# EAGLE schematic inverter-1kw (EAGLE 9.6.2)
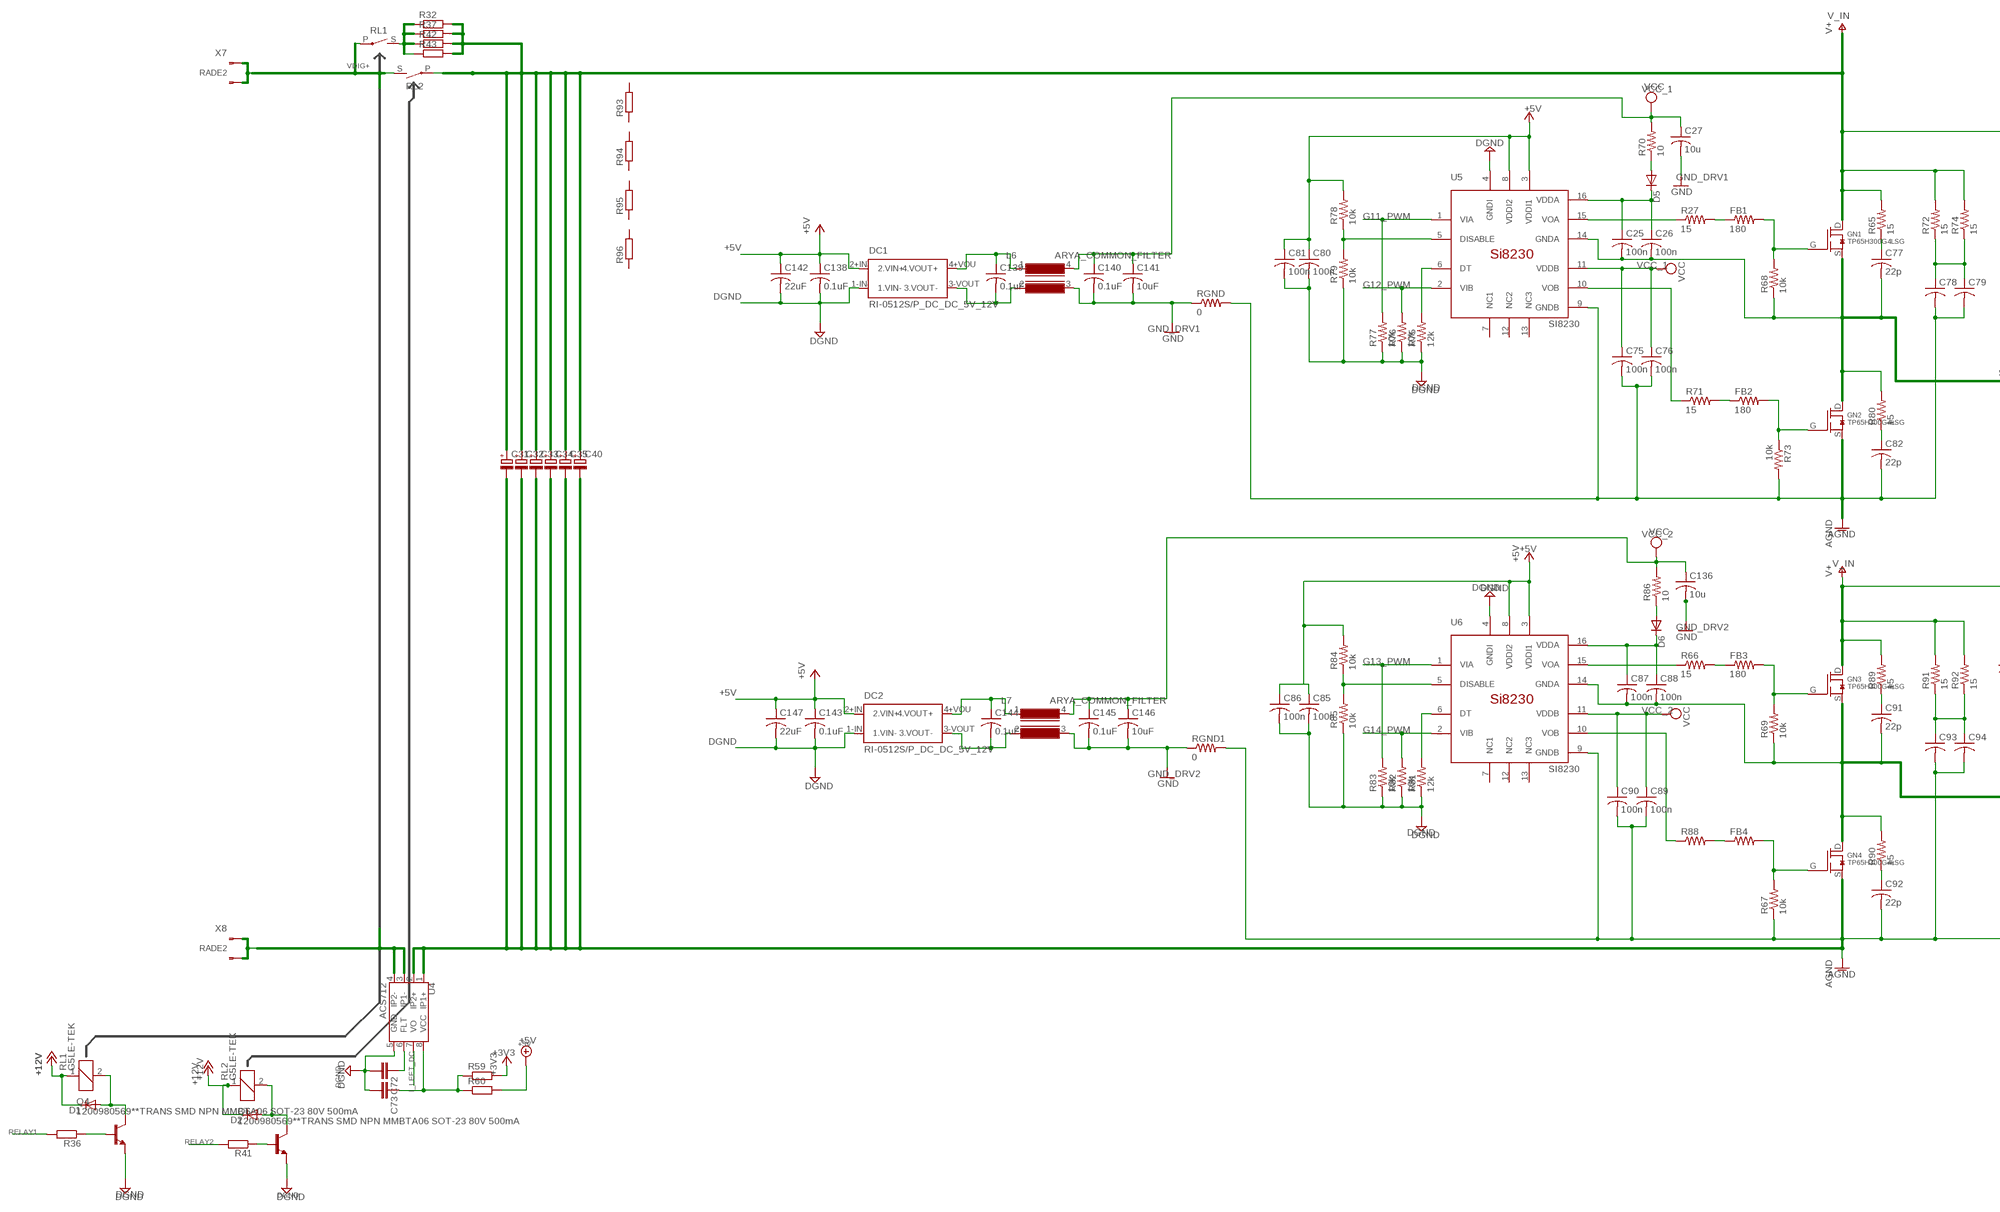
[diagram p0: schematic, sheet 1, part 1 of 3]
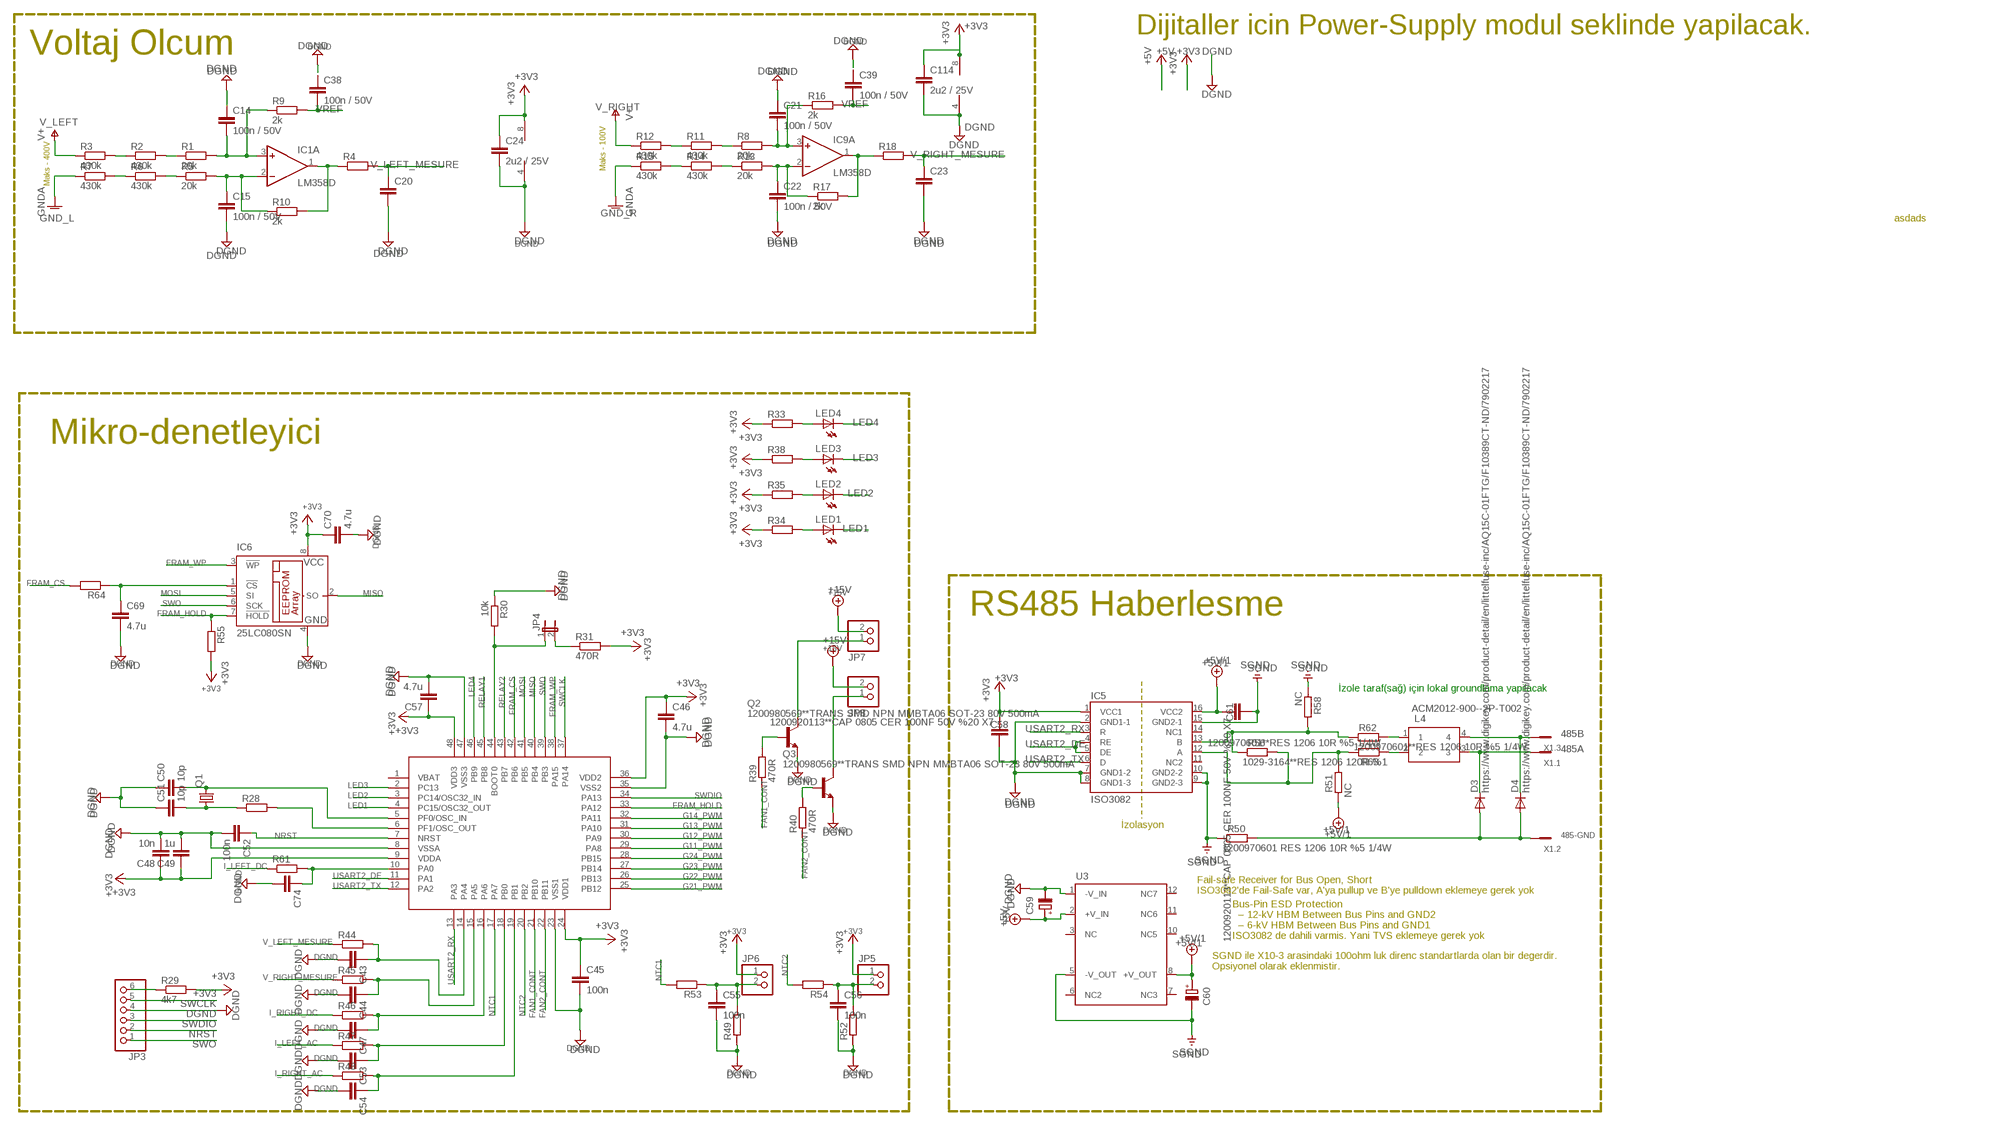
[diagram p1: schematic, sheet 1, part 2 of 3]
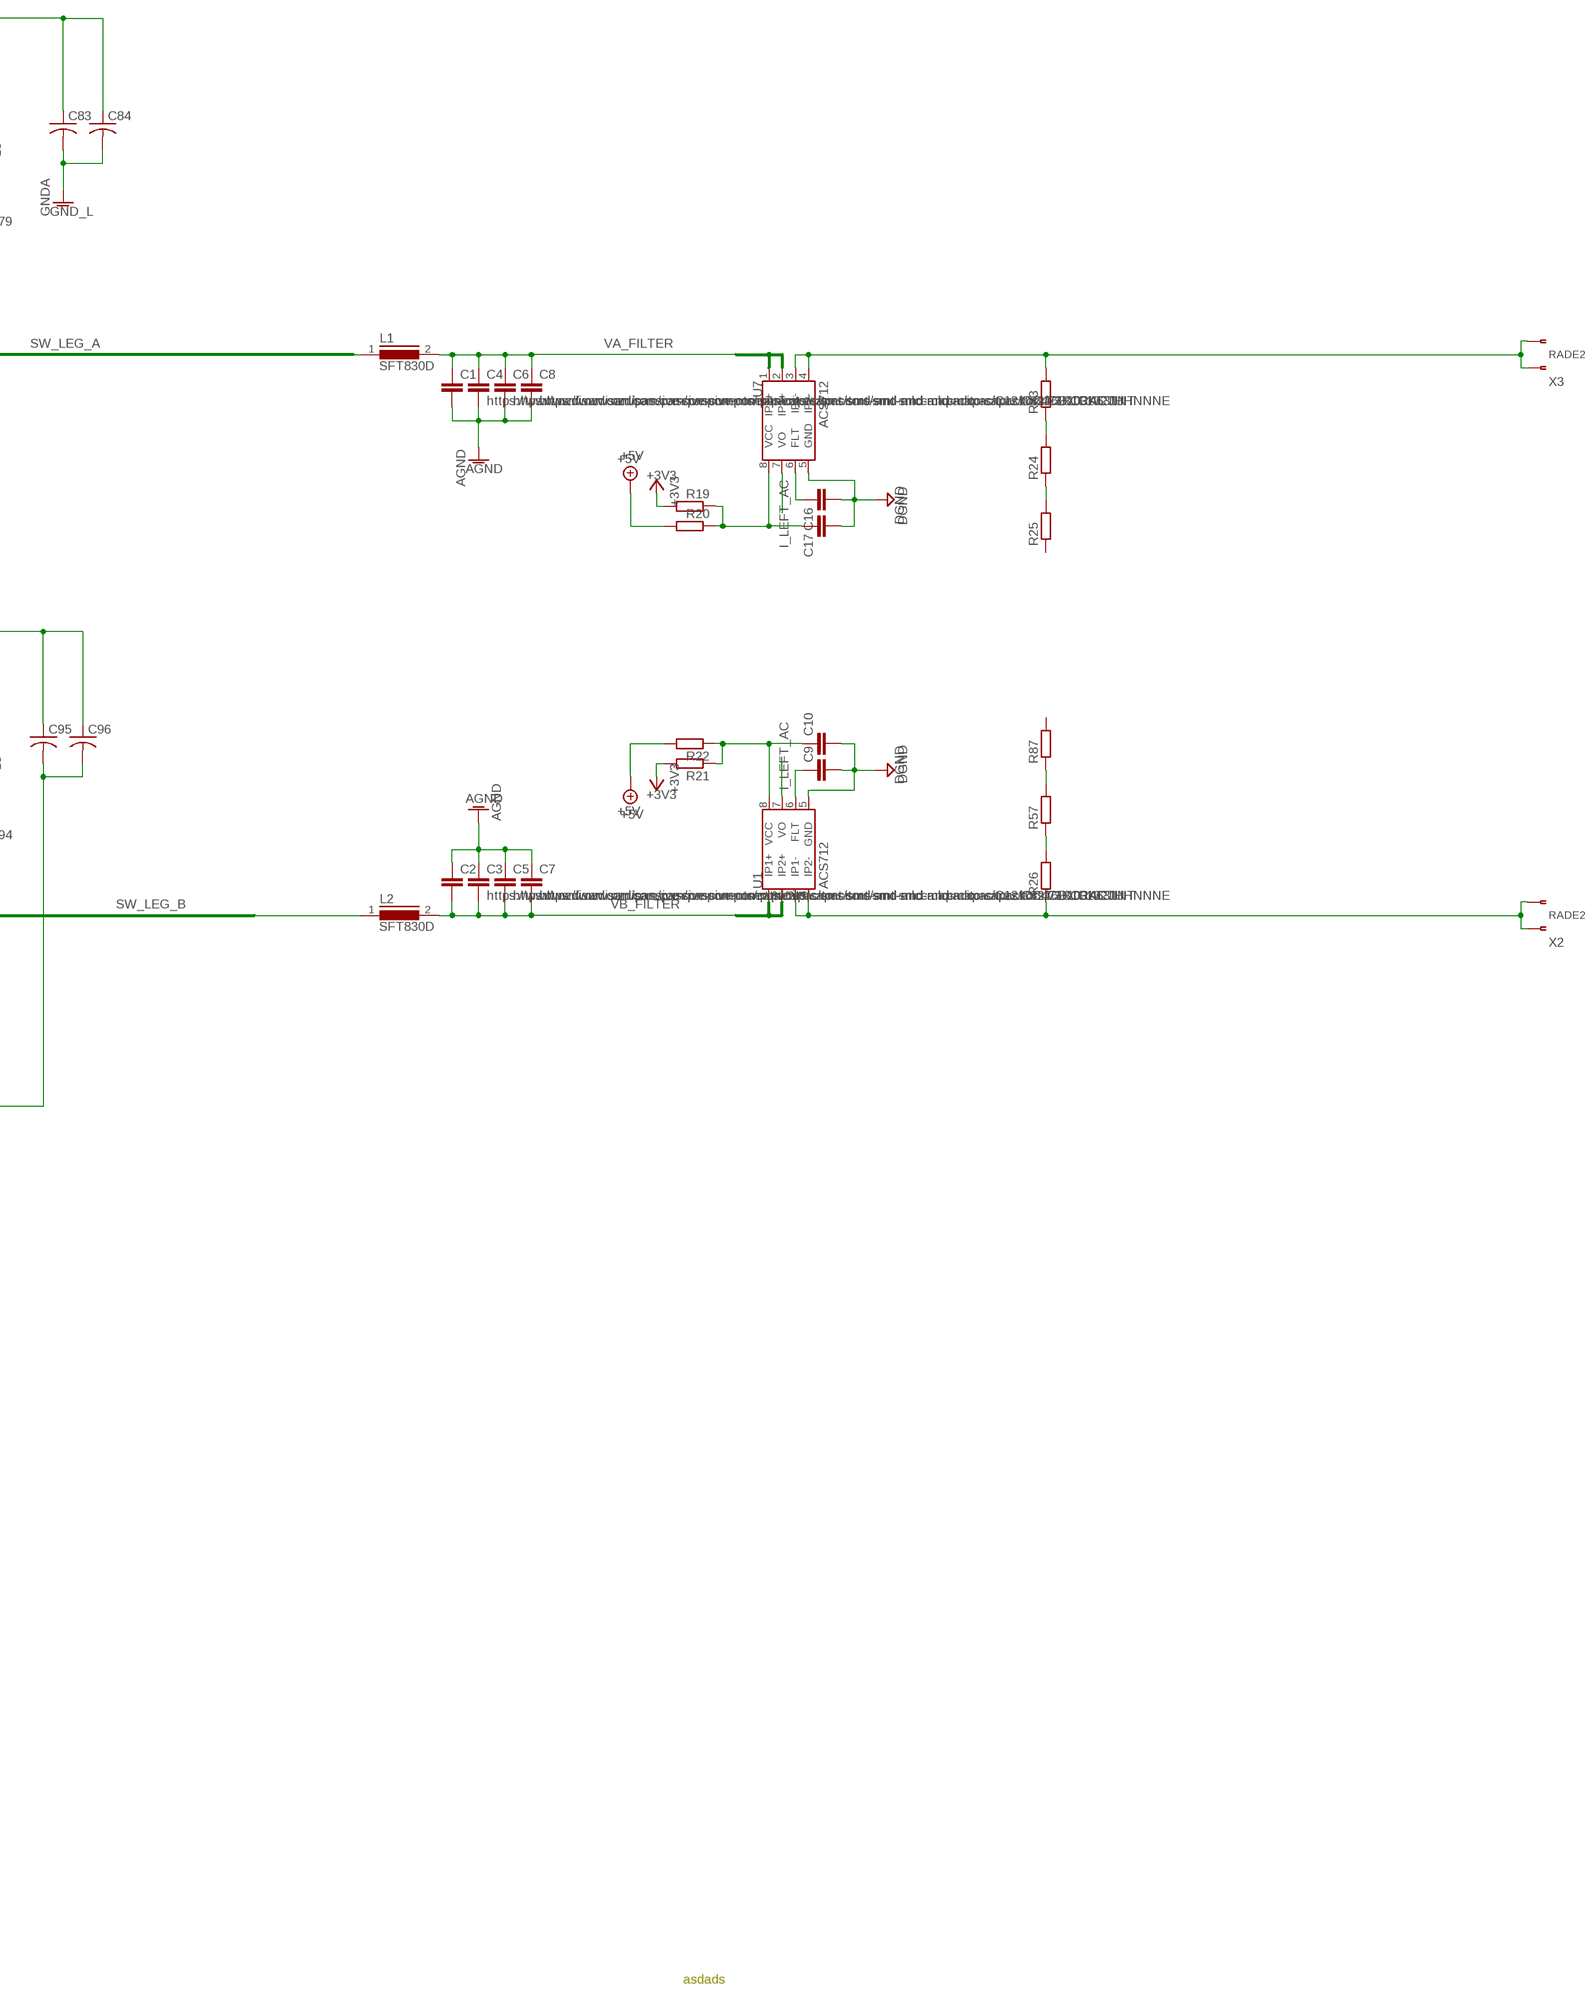
[diagram p2: schematic, sheet 1, part 3 of 3]

## Parts
C1  C-EUC2225K  [C2225K]
C2  C-EUC2225K  [C2225K]
C3  https://www.ozdisan.com/passive-components/capacitors/smt-smd-and-mlcc-capacitors/C1210C473KCRACTU  C-EUC1210K  [C1210K]
C4  https://www.ozdisan.com/passive-components/capacitors/smt-smd-and-mlcc-capacitors/C1210C473KCRACTU  C-EUC1210K  [C1210K]
C5  https://www.ozdisan.com/passive-components/capacitors/smt-smd-and-mlcc-capacitors/C3216B103K631NT  C-EUC1206  [C1206]
C6  https://www.ozdisan.com/passive-components/capacitors/smt-smd-and-mlcc-capacitors/C3216B103K631NT  C-EUC1206  [C1206]
C7  https://www.ozdisan.com/passive-components/capacitors/smt-smd-and-mlcc-capacitors/CL31C102JHHNNNE  C-EUC1206  [C1206]
C8  https://www.ozdisan.com/passive-components/capacitors/smt-smd-and-mlcc-capacitors/CL31C102JHHNNNE  C-EUC1206  [C1206]
C9  C-EUC0805  [C0805]
C10  C-EUC0805  [C0805]
C14  100n / 50V  C-EUC1206  [C1206]
C15  100n / 50V  C-EUC1206  [C1206]
C16  C-EUC0805  [C0805]
C17  C-EUC0805  [C0805]
C20  C-EUC0805  [C0805]
C21  100n / 50V  C-EUC1206  [C1206]
C22  100n / 50V  C-EUC1206  [C1206]
C23  C-EUC0805  [C0805]
C24  2u2 / 25V  C-EUC0805  [C0805]
C25  100n  C-USC0805  [C0805]
C26  100n  C-USC0805  [C0805]
C27  10u  C-USC1206  [C1206]
C31  CPOL-EUE7.5-18  [E7,5-18]
C32  CPOL-EUE7.5-18  [E7,5-18]
C33  CPOL-EUE7.5-18  [E7,5-18]
C34  CPOL-EUE7.5-18  [E7,5-18]
C35  CPOL-EUE7.5-18  [E7,5-18]
C38  100n / 50V  C-EUC1206  [C1206]
C39  100n / 50V  C-EUC1206  [C1206]
C40  CPOL-EUE7.5-18  [E7,5-18]
C43  C-EUC0805  [C0805]
C44  C-EUC0805  [C0805]
C45  100n  C-EUC0805  [C0805]
C46  4.7u  C-EUC1206  [C1206]
C47  C-EUC0805  [C0805]
C48  10n  C-EUC0805  [C0805]
C49  1u  C-EUC1206  [C1206]
C50  10p  C-EUC0805  [C0805]
C51  10p  C-EUC0805  [C0805]
C52  100n  C-EUC0805  [C0805]
C53  C-EUC0805  [C0805]
C54  C-EUC0805  [C0805]
C55  100n  C-EUC0805  [C0805]
C56  100n  C-EUC0805  [C0805]
C57  4.7u  C-EUC1206  [C1206]
C58  1200920113**CAP 0805 CER 100NF 50V %20 X7  C-EUC0805  [C0805]
C59  1019-3202 CAP SMD AL. ELEC 4.7uF 16V %20 85C  CPOL-EU153CLV-0405  [153CLV-0405]
C60  1019-3203 CAP SMD AL. ELEC 10uF 16V %20 85C Dxh(4x5.3mm)  CPOL-EU153CLV-0405  [153CLV-0405]
C61  1200920113**CAP 0805 CER 100NF 50V %20 X7  C-EUC0805  [C0805]
C69  4.7u  C-EUC1206  [C1206]
C70  4.7u  C-EUC1206  [C1206]
C72  C-EUC0805  [C0805]
C73  C-EUC0805  [C0805]
C74  C-EUC0805  [C0805]
C75  100n  C-USC0805  [C0805]
C76  100n  C-USC0805  [C0805]
C77  22p  C-USC1206  [C1206]
C78  C-USC1206  [C1206]
C79  C-USC1206  [C1206]
C80  100n  C-USC0603  [C0603]
C81  100n  C-USC0603  [C0603]
C82  22p  C-USC1206  [C1206]
C83  C-USC1206  [C1206]
C84  C-USC1206  [C1206]
C85  100n  C-USC0603  [C0603]
C86  100n  C-USC0603  [C0603]
C87  100n  C-USC0805  [C0805]
C88  100n  C-USC0805  [C0805]
C89  100n  C-USC0805  [C0805]
C90  100n  C-USC0805  [C0805]
C91  22p  C-USC1206  [C1206]
C92  22p  C-USC1206  [C1206]
C93  C-USC1206  [C1206]
C94  C-USC1206  [C1206]
C95  C-USC1206  [C1206]
C96  C-USC1206  [C1206]
C114  2u2 / 25V  C-EUC0805  [C0805]
C136  10u  C-USC1206  [C1206]
C138  0.1uF  C-USC0603  [C0603]
C139  0.1uF  C-USC0805  [C0805]
C140  0.1uF  C-USC0805  [C0805]
C141  10uF  C-USC0805  [C0805]
C142  22uF  C-USC1206  [C1206]
C143  0.1uF  C-USC0603  [C0603]
C144  0.1uF  C-USC0805  [C0805]
C145  0.1uF  C-USC0805  [C0805]
C146  10uF  C-USC0805  [C0805]
C147  22uF  C-USC1206  [C1206]
D1  DIODE-SOD123  [SOD123]
D2  DIODE-SOD123  [SOD123]
D3  https://www.digikey.com/product-detail/en/littelfuse-inc/AQ15C-01FTG/F10389CT-ND/7902217  DIODE-SOD323-W  [SOD323-W]
D4  https://www.digikey.com/product-detail/en/littelfuse-inc/AQ15C-01FTG/F10389CT-ND/7902217  DIODE-SOD323-W  [SOD323-W]
D5  DIODE-DO214AC  [DO214AC]
D6  DIODE-DO214AC  [DO214AC]
DC1  RI-0512S/P_DC_DC_5V_12V  [RI-0512S/P_DC_DC_5V_12V]
DC2  RI-0512S/P_DC_DC_5V_12V  [RI-0512S/P_DC_DC_5V_12V]
FB1  180  R-US_R0603  [R0603]
FB2  180  R-US_R0603  [R0603]
FB3  180  R-US_R0603  [R0603]
FB4  R-US_R0603  [R0603]
GN1  TP65H300G4LSG  [TP65H300G4LSG]
GN2  TP65H300G4LSG  [TP65H300G4LSG]
GN3  TP65H300G4LSG  [TP65H300G4LSG]
GN4  TP65H300G4LSG  [TP65H300G4LSG]
IC1  LM358D  [SO08]
IC5  ISO3082  [ISO3082]
IC6  25LC080SN  [SO-08]
IC9  LM358D  [SO08]
JP3  PINHD-1X6  [1X06]
JP4  JP1E  [JP1]
JP5  PINHD-1X2  [1X02]
JP6  PINHD-1X2  [1X02]
JP7  PINHD-1X2  [1X02]
JP8  PINHD-1X2  [1X02]
L1  SFT830D  [SFT830D]
L2  SFT830D  [SFT830D]
L4  ACM2012-900--2P-T002  [ACM2012-900--2P-T002]
L6  ARYA_COMMON_FILTER  [ARYA_COMMON_FILTER]
L7  ARYA_COMMON_FILTER  [ARYA_COMMON_FILTER]
LED1  LEDSMT1206  [1206]
LED2  LEDSMT1206  [1206]
LED3  LEDSMT1206  [1206]
LED4  LEDSMT1206  [1206]
Q1  CRYSTALSM49  [SM49]
Q2  1200980569**TRANS SMD NPN MMBTA06 SOT-23 80V 500mA  BC846ALT1SMD  [SOT23]
Q3  1200980569**TRANS SMD NPN MMBTA06 SOT-23 80V 500mA  BC846ALT1SMD  [SOT23]
Q4  1200980569**TRANS SMD NPN MMBTA06 SOT-23 80V 500mA  BC846ALT1SMD  [SOT23]
Q6  1200980569**TRANS SMD NPN MMBTA06 SOT-23 80V 500mA  BC846ALT1SMD  [SOT23]
R1  20k  R-EU_R1206  [R1206]
R2  430k  R-EU_R1206  [R1206]
R3  430k  R-EU_R1206  [R1206]
R4  R-EU_R0805  [R0805]
R5  20k  R-EU_R1206  [R1206]
R6  430k  R-EU_R1206  [R1206]
R7  430k  R-EU_R1206  [R1206]
R8  20k  R-EU_R1206  [R1206]
R9  2k  R-EU_R1206  [R1206]
R10  2k  R-EU_R1206  [R1206]
R11  430k  R-EU_R1206  [R1206]
R12  430k  R-EU_R1206  [R1206]
R13  20k  R-EU_R1206  [R1206]
R14  430k  R-EU_R1206  [R1206]
R15  430k  R-EU_R1206  [R1206]
R16  2k  R-EU_R1206  [R1206]
R17  2k  R-EU_R1206  [R1206]
R18  R-EU_R0805  [R0805]
R19  R-EU_R0603  [R0603]
R20  R-EU_R0603  [R0603]
R21  R-EU_R0603  [R0603]
R22  R-EU_R0603  [R0603]
R23  R-EU_R1206  [R1206]
R24  R-EU_R1206  [R1206]
R25  R-EU_R1206  [R1206]
R26  R-EU_R1206  [R1206]
R27  15  R-US_R0603  [R0603]
R28  R-EU_R0805  [R0805]
R29  4k7  R-EU_R0805  [R0805]
R30  10k  R-EU_R0805  [R0805]
R31  470R  R-EU_R0805  [R0805]
R32  R-EU_0411/12  [0411/12]
R33  R-EU_R0805  [R0805]
R34  R-EU_R0805  [R0805]
R35  R-EU_R0805  [R0805]
R36  R-EU_R0805  [R0805]
R37  R-EU_0411/12  [0411/12]
R38  R-EU_R0805  [R0805]
R39  470R  R-EU_R0805  [R0805]
R40  470R  R-EU_R0805  [R0805]
R41  R-EU_R0805  [R0805]
R42  R-EU_0411/12  [0411/12]
R43  R-EU_0411/12  [0411/12]
R44  R-EU_R0603  [R0603]
R45  R-EU_R0603  [R0603]
R46  R-EU_R0603  [R0603]
R47  R-EU_R0603  [R0603]
R48  R-EU_R0603  [R0603]
R49  R-EU_R0603  [R0603]
R50  1200970601 RES 1206 10R %5 1/4W  R-EU_R1206  [R1206]
R51  NC  R-EU_R0805  [R0805]
R52  R-EU_R0603  [R0603]
R53  R-EU_R0603  [R0603]
R54  R-EU_R0603  [R0603]
R55  R-EU_R0805  [R0805]
R56  1029-3164**RES 1206 120R %1  R-EU_R1206  [R1206]
R57  R-EU_R1206  [R1206]
R58  NC  R-EU_R0805  [R0805]
R59  R-EU_R0603  [R0603]
R60  R-EU_R0603  [R0603]
R61  R-EU_R0603  [R0603]
R62  1200970601**RES 1206 10R %5 1/4W  R-EU_R1206  [R1206]
R63  1200970601**RES 1206 10R %5 1/4W  R-EU_R1206  [R1206]
R64  R-EU_R0805  [R0805]
R65  15  R-US_R1206  [R1206]
R66  15  R-US_R0603  [R0603]
R67  10k  R-US_R0603  [R0603]
R68  10k  R-US_R0603  [R0603]
R69  10k  R-US_R0603  [R0603]
R70  10  R-US_R1206  [R1206]
R71  15  R-US_R0603  [R0603]
R72  15  R-US_R1206  [R1206]
R73  10k  R-US_R0603  [R0603]
R74  15  R-US_R1206  [R1206]
R75  12k  R-US_R0603  [R0603]
R76  10k  R-US_R0603  [R0603]
R77  10k  R-US_R0603  [R0603]
R78  10k  R-US_R0603  [R0603]
R79  10k  R-US_R0603  [R0603]
R80  15  R-US_R1206  [R1206]
R81  12k  R-US_R0603  [R0603]
R82  10k  R-US_R0603  [R0603]
R83  10k  R-US_R0603  [R0603]
R84  10k  R-US_R0603  [R0603]
R85  10k  R-US_R0603  [R0603]
R86  10  R-US_R1206  [R1206]
R87  R-EU_R1206  [R1206]
R88  R-US_R0603  [R0603]
R89  15  R-US_R1206  [R1206]
R90  15  R-US_R1206  [R1206]
R91  15  R-US_R1206  [R1206]
R92  15  R-US_R1206  [R1206]
R93  R-EU_R1206  [R1206]
R94  R-EU_R1206  [R1206]
R95  R-EU_R1206  [R1206]
R96  R-EU_R1206  [R1206]
RGND  0  R-US_R0603  [R0603]
RGND1  0  R-US_R0603  [R0603]
RL1  G5LE-TEK  [G5LE-TEK]
RL2  G5LE-TEK  [G5LE-TEK]
U1  ACS712  [SOIC8]
U2  STM32F334C6  [LQFP48]
U3  1039-2088**AM1L-0505SH30-NZ AIMTEC 85C SMD DC-DC Converter  LF101ESI  [LF101ESI]
U4  ACS712  [SOIC8]
U5  SI8230  [SI8230-N]
U6  SI8230  [SI8230-N]
U7  ACS712  [SOIC8]
X1  MCV3  [MCV3]
X2  RADE2  [RADE2]
X3  RADE2  [RADE2]
X7  RADE2  [RADE2]
X8  RADE2  [RADE2]

## Nets
400V-: U4.3(IP1-) U4.4(IP2-) X8.1 X8.2
485A: D3.C L4.3 X1.1
485B: L4.1 R62.2
+3V3: C24.1 C45.1 C46.1 C48.1 C49.1 C57.1 C58.2 C70.1 C114.1 IC1.8(P:V+) IC5.1(VCC1) IC6.8(VCC) IC9.8(P:V+) JP5.1 JP6.1 R19.2 R21.2 R29.2 R31.2 R33.1 R34.1 R35.1 R38.1 R55.2 R59.2 U2.9(VDDA) U2.24(VDD1) U2.36(VDD2) U2.48(VDD3)
+5V: C59.+ C80.1 C81.1 C85.1 C86.1 C138.1 C142.1 C143.1 C147.1 DC1.2+IN(2.VIN+) DC2.2+IN(2.VIN+) R20.2 R22.2 R60.2 R78.2 R84.2 U3.2(+V_IN) U5.3(VDDI1) U5.8(VDDI2) U6.3(VDDI1) U6.8(VDDI2)
+5V/1: C60.+ C61.2 IC5.16(VCC2) R51.1 U3.8(+V_OUT)
+12V: D1.C D2.C RL1.1 RL2.1
+15V: JP7.2 JP8.2
AGND: C1.2 C2.1 C3.1 C4.2 C5.1 C6.2 C7.1 C8.2 C31.- C32.- C33.- C34.- C35.- C40.- C75.2 C76.2 C78.2 C79.2 C82.2 C89.2 C90.2 C92.2 C93.2 C94.2 C95.2 C96.2 GN2.S GN4.S R67.1 R73.2 RGND1.2 RGND.2 U4.1(IP1+) U4.2(IP2+) U5.9(GNDB) U6.9(GNDB)
DGND: C9.2 C10.2 C14.1 C15.2 C16.2 C17.2 C20.2 C21.1 C22.2 C23.2 C24.2 C38.1 C39.1 C43.2 C44.2 C45.2 C46.2 C47.2 C48.2 C49.2 C50.1 C51.1 C52.2 C53.2 C54.2 C55.2 C56.2 C57.2 C58.1 C59.- C69.2 C70.2 C72.2 C73.2 C74.2 C80.2 C81.2 C85.2 C86.2 C114.2 C138.2 C142.2 C143.2 C147.2 DC1.1-IN(1.VIN-) DC2.1-IN(1.VIN-) IC1.4(P:V-) IC5.2(GND1-1) IC5.7(GND1-2) IC5.8(GND1-3) IC6.4(GND) IC9.4(P:V-) JP3.4 Q2.2(E) Q3.2(E) Q4.2(E) Q6.2(E) R30.1 R49.1 R52.1 R75.1 R76.1 R77.1 R79.1 R81.1 R82.1 R83.1 R85.1 U1.5(GND) U2.8(VSSA) U2.23(VSS1) U2.35(VSS2) U2.47(VSS3) U3.1(-V_IN) U4.5(GND) U5.4(GNDI) U6.4(GNDI) U7.5(GND)
FAN1_CONT: R39.1 U2.21(PB10)
FAN2_CONT: R40.1 U2.22(PB11)
FRAM_CS: R64.2 U2.42(PB6)
FRAM_HOLD: IC6.7(!HOLD) R55.1 U2.33(PA12)
FRAM_WP: IC6.3(!WP) U2.38(PA15)
G11_PWM: R77.2 U2.29(PA8) U5.1(VIA)
G12_PWM: R76.2 U2.30(PA9) U5.2(VIB)
G13_PWM: R83.2 U2.31(PA10) U6.1(VIA)
G14_PWM: R82.2 U2.32(PA11) U6.2(VIB)
G21_PWM: U2.25(PB12)
G22_PWM: U2.26(PB13)
G23_PWM: U2.27(PB14)
G24_PWM: U2.28(PB15)
GND_DRV1: C27.2 C140.2 C141.2 L6.3 RGND.1 ; supply symbol labelled GND
GND_DRV2: C136.2 C145.2 C146.2 L7.3 RGND1.1 ; supply symbol labelled GND
GND_L: C83.2 C84.2 R7.1 ; supply symbol labelled GNDA
GND_R: R15.1 ; supply symbol labelled GNDA
I_LEFT_AC: R47.1 U1.7(VO) U7.7(VO)
I_LEFT_DC: R61.1 U4.7(VO)
I_RIGHT_AC: R48.1
I_RIGHT_DC: R46.1
LED1: LED1.C U2.4(PC15/OSC32_OUT)
LED2: LED2.C U2.3(PC14/OSC32_IN)
LED3: LED3.C U2.2(PC13)
LED4: LED4.C U2.46(PB9)
MISO: IC6.2(SO) U2.40(PB4)
MOSI: IC6.5(SI) U2.41(PB5)
N$1: R26.1 U1.3(IP1-) U1.4(IP2-) X2.1 X2.2
N$2: R23.2 U7.3(IP1-) U7.4(IP2-) X3.1 X3.2
N$3: D5.A R70.1
N$5: R75.2 U5.6(DT)
N$6: R23.1 R24.2
N$7: C14.2 IC1.3(A:+IN) R1.2 R9.1
N$8: C9.1 U1.6(FLT)
N$9: C15.1 IC1.2(A:-IN) R5.2 R10.1
N$10: R5.1 R6.2
N$11: R6.1 R7.2
N$12: R13.1 R14.2
N$13: R14.1 R15.2
N$14: L4.2 R63.1
N$15: R2.1 R3.2
N$16: R1.1 R2.2
N$17: R11.1 R12.2
N$18: IC1.1(A:OUT) R4.1 R10.2
N$19: R8.1 R11.2
N$20: C21.2 IC9.3(A:+IN) R8.2 R16.1
N$21: C16.1 U7.6(FLT)
N$22: R28.2 U2.6(PF1/OSC_OUT)
N$23: C22.1 IC9.2(A:-IN) R13.2 R17.1
N$24: C10.1 R21.1 R22.1 U1.8(VCC)
N$25: IC9.1(A:OUT) R17.2 R18.1
N$26: R24.1 R25.2
N$27: R26.2 R57.1
N$28: R57.2 R87.1
N$29: FB1.2 GN1.G R68.2
N$30: C17.1 R19.1 R20.1 U7.8(VCC)
N$33: C51.2 Q1.1 R28.1
N$34: C50.2 Q1.2 U2.5(PF0/OSC_IN)
N$35: IC5.13(B) R56.1 R58.2 R62.1
N$36: IC5.12(A) R51.2 R56.2 R63.2
N$37: JP3.6 R29.1
N$38: JP4.1 R30.2 U2.44(BOOT0)
N$39: JP4.2 R31.1
N$40: LED2.A R35.2
N$41: C53.1 R47.2 U2.18(PB0)
N$42: LED1.A R34.2
N$43: LED4.A R33.2
N$44: D1.A Q4.3(C) RL1.2
N$45: Q4.1(B) R36.1
N$46: C55.1 JP6.2 R49.2 R53.1
N$47: C54.1 R48.2 U2.19(PB1)
N$48: LED3.A R38.2
N$49: C43.1 R44.2 U2.14(PA4)
N$50: C44.1 R45.2 U2.15(PA5)
N$51: D2.A Q6.3(C) RL2.2
N$52: Q6.1(B) R41.1
N$53: C47.1 R46.2 U2.16(PA6)
N$55: R32.1 R37.1 R42.1 R43.1 RL1.S
N$57: R66.1 U6.15(VOA)
N$59: JP8.1 Q3.3(C)
N$60: JP7.1 Q2.3(C)
N$61: C56.1 JP5.2 R52.2 R54.1
N$62: Q2.1(B) R39.2
N$63: C69.1 IC6.1(!CS) R64.1
N$64: Q3.1(B) R40.2
N$65: D4.C L4.4 X1.3
N$66: C74.1 R61.2 U2.10(PA0)
N$67: D3.A D4.A R50.2 X1.2
N$69: C73.1 R59.1 R60.1 U4.8(VCC)
N$70: C72.1 U4.6(FLT)
N$71: FB3.1 R66.2
N$72: FB3.2 GN3.G R69.2
N$73: R27.1 U5.15(VOA)
N$74: FB1.1 R27.2
N$75: FB2.2 GN2.G R73.1
N$76: FB2.1 R71.2
N$77: D6.A R86.1
N$78: R71.1 U5.10(VOB)
N$79: C78.1 C79.1 R72.1 R74.1
N$80: C77.1 R65.1
N$81: FB4.2 GN4.G R67.2
N$82: R81.2 U6.6(DT)
N$83: R78.1 R79.2 U5.5(DISABLE)
N$84: FB4.1 R88.2
N$85: C82.1 R80.1
N$86: R88.1 U6.10(VOB)
N$88: R84.1 R85.2 U6.5(DISABLE)
N$90: C91.1 R89.1
N$92: C92.1 R90.1
N$95: C93.1 C94.1 R91.1 R92.1
N$130: C139.1 DC1.4+VOU(4.VOUT+) L6.1
N$131: C144.2 DC2.3-VOUT(3.VOUT-) L7.2
N$132: C144.1 DC2.4+VOU(4.VOUT+) L7.1
N$138: C139.2 DC1.3-VOUT(3.VOUT-) L6.2
NRST: C52.1 JP3.2 U2.7(NRST)
NTC1: R53.2 U2.17(PA7)
NTC2: R54.2 U2.20(PB2)
RELAY1: R36.2 U2.45(PB8)
RELAY2: R41.2 U2.43(PB7)
SGND: C60.- C61.1 IC5.9(GND2-3) IC5.10(GND2-2) IC5.15(GND2-1) R50.1 R58.1 U3.5(-V_OUT)
SW_LEG_A: C25.2 C26.2 C77.2 GN1.S GN2.D L1.1 R68.1 R80.2 U5.14(GNDA)
SW_LEG_B: C87.2 C88.2 C91.2 GN3.S GN4.D L2.1 R69.1 R90.2 U6.14(GNDA)
SWCLK: JP3.5 U2.37(PA14)
SWDIO: JP3.3 U2.34(PA13)
SWO: IC6.6(SCK) JP3.1 U2.39(PB3)
USART2_DE: IC5.4(RE) IC5.5(DE) U2.11(PA1)
USART2_RX: IC5.3(R) U2.13(PA3)
USART2_TX: IC5.6(D) U2.12(PA2)
V_IN: C31.+ C32.+ C33.+ C34.+ C35.+ C40.+ C83.1 C84.1 C95.1 C96.1 GN1.D GN3.D R32.2 R37.2 R42.2 R43.2 R65.2 R72.2 R74.2 R89.2 R91.2 R92.2 RL2.P ; supply symbol labelled V+
V_LEFT: R3.1 ; supply symbol labelled V+
V_LEFT_MESURE: C20.1 R4.2 R44.1
V_RIGHT: R12.1 ; supply symbol labelled V+
V_RIGHT_MESURE: C23.1 R18.2 R45.1
VA_FILTER: C1.1 C4.1 C6.1 C8.1 L1.2 U7.1(IP1+) U7.2(IP2+)
VB_FILTER: C2.2 C3.2 C5.2 C7.2 L2.2 U1.1(IP1+) U1.2(IP2+)
VCC_1: C27.1 C75.1 C76.1 C140.1 C141.1 L6.4 R70.2 U5.11(VDDB) ; supply symbol labelled VCC
VCC_2: C89.1 C90.1 C136.1 C145.1 C146.1 L7.4 R86.2 U6.11(VDDB) ; supply symbol labelled VCC
VDDA: C25.1 C26.1 C87.1 C88.1 D5.C D6.C U5.16(VDDA) U6.16(VDDA)
VDIG+: RL1.P RL2.S X7.1 X7.2
VREF: C38.2 C39.2 R9.2 R16.2
Unconnected: IC1.5(B:+IN) IC1.6(B:-IN) IC1.7(B:OUT) IC5.11(NC2) IC5.14(NC1) IC9.5(B:+IN) IC9.6(B:-IN) IC9.7(B:OUT) R25.1 R87.2 R93.1 R93.2 R94.1 R94.2 R95.1 R95.2 R96.1 R96.2 U3.3(NC) U3.6(NC2) U3.7(NC3) U3.10(NC5) U3.11(NC6) U3.12(NC7) U5.7(NC1) U5.12(NC2) U5.13(NC3) U6.7(NC1) U6.12(NC2) U6.13(NC3)

## Notes on the sheet
- Dijitaller icin Power-Supply modul seklinde yapilacak.
- Voltaj Olcum
- Maks - 100V
- Maks - 400V
- asdads
- asdads
- Mikro-denetleyici
- RS485 Haberlesme
- İzole taraf(sağ) için lokal groundlama yapilacak
- 485A
- İzolasyon
- 485-GND
- Fail-safe Receiver for Bus Open, Short 
  ISO3082'de Fail-Safe var, A'ya pullup ve B'ye pulldown eklemeye gerek yok
- Bus-Pin ESD Protection 
    – 12-kV HBM Between Bus Pins and GND2 
    – 6-kV HBM Between Bus Pins and GND1
  ISO3082 de dahili varmis. Yani TVS eklemeye gerek yok
- SGND ile X10-3 arasindaki 100ohm luk direnc standartlarda olan bir degerdir.
  Opsiyonel olarak eklenmistir.

## Power pins joined to a net without a drawn wire
VBAT: U2.1(VBAT)

## Library data of the parts
C1-C8 = rcl:C-EU: CAPACITOR, European symbol; SPICEPREFIX: C
C9 C10 C14-C17 C20-C24 C38 C39 C43-C58 C61 C69 C70 C72-C74 C114 = rcl:C-EU: CAPACITOR, European symbol
C25-C27 C75 C76 C80 C81 C85-C90 C136 C138-C147 = rcl:C-US: CAPACITOR, American symbol
C31-C35 C40 C59 C60 = rcl:CPOL-EU: POLARIZED CAPACITOR, European symbol
C77-C79 C82-C84 C91-C96 = resistor:C-US: CAPACITOR, American symbol
D1-D6 = diode:DIODE-: DIODE
DC1 DC2 = my_parts1:RI-0512S/P_DC_DC_5V_12V
FB1-FB4 R27 R65-R86 R88-R92 RGND RGND1 = rcl:R-US_: RESISTOR, American symbol
GN1-GN4 = my_parts1:TP65H300G4LSG
IC1 IC9 = linear:LM358: OP AMP also LM158; LM258; LM2904 Source: http://cache.national.com/ds/LM/LM158.pdf
IC5 = enko:ISO3082
IC6 = microchip:25*: Serial EEPROM 4K/ 8K , SPI bus; MF: MICROCHIP; MPN: 25LC080/SN; OC_FARNELL: 1137302; OC_NEWARK: 96K4092
JP3 = pinhead:PINHD-1X6: PIN HEADER
JP4 = jumper:JP1E: JUMPER
JP5-JP8 = pinhead:PINHD-1X2: PIN HEADER
L1 L2 = inductors:SFT830D: INDUCTOR; SPICEPREFIX: L
L4 = enko:ACM2012-900--2P-T002
L6 L7 = enko:ARYA_COMMON_FILTER
LED1-LED4 = led:LED: LED OSRAM: - CHIPLED LG R971, LG N971, LY N971, LG Q971, LY Q971, LO R971, LY R971 LH N974, LH R974 LS Q976, LO Q976, LY Q976 LO Q996 - Hyper CHIPLED LW Q18S LB Q993, LB Q99A, LB R99A - SideLED LS A670, LO A670, LY A670, LG A670, LP A670 LB A673, LV A673, LT A673, LW A673 LH A674 LY A675 LS A676, LA A676, LO A676, LY A676, LW A676 LS A679, LY A679, LG A679 - Hyper Micro SIDELED® LS Y876, LA Y876, LO Y876, LY Y876 LT Y87S - SmartLED LW L88C, LW L88S LB L89C, LB L89S, LG L890 LS L89K, LO L89K, LY L89K LS L896, LA L896, LO L896, LY L896 - TOPLED LS T670, LO T670, LY T670, LG T670, LP T670 LSG T670, LSP T670, LSY T670, LOP T670, LYG T670 LG T671, LOG T671, LSG T671 LB T673, LV T673, LT T673, LW T673 LH T674 LS T676, LA T676, LO T676, LY T676, LB T676, LH T676, LSB T676, LW T676 LB T67C, LV T67C, LT T67C, LS T67K, LO T67K, LY T67K, LW E67C LS E67B, LA E67B, LO E67B, LY E67B, LB E67C, LV E67C, LT E67C LW T67C LS T679, LY T679, LG T679 LS T770, LO T770, LY T770, LG T770, LP T770 LB T773, LV T773, LT T773, LW T773 LH T774 LS E675, LA E675, LY E675, LS T675 LS T776, LA T776, LO T776, LY T776, LB T776 LHGB T686 LT T68C, LB T68C - Hyper Mini TOPLED® LB M676 - Mini TOPLED Santana® LG M470 LS M47K, LO M47K, LY M47K Source: http://www.osram.convergy.de LUXEON: - LUMILED® LXK2-PW12-R00, LXK2-PW12-S00, LXK2-PW14-U00, LXK2-PW14-V00 LXK2-PM12-R00, LXK2-PM12-S00, LXK2-PM14-U00 LXK2-PE12-Q00, LXK2-PE12-R00, LXK2-PE12-S00, LXK2-PE14-T00, LXK2-PE14-U00 LXK2-PB12-K00, LXK2-PB12-L00, LXK2-PB12-M00, LXK2-PB14-N00, LXK2-PB14-P00, LXK2-PB14-Q00 LXK2-PR12-L00, LXK2-PR12-M00, LXK2-PR14-Q00, LXK2-PR14-R00 LXK2-PD12-Q00, LXK2-PD12-R00, LXK2-PD12-S00 LXK2-PH12-R00, LXK2-PH12-S00 LXK2-PL12-P00, LXK2-PL12-Q00, LXK2-PL12-R00 Source: www.luxeon.com KINGBRIGHT: KA-3528ASYC Source: www.kingbright.com
Q1 = crystal:CRYSTAL: CRYSTAL; OC_FARNELL: unknown; OC_NEWARK: unknown
Q2-Q4 Q6 = transistor-npn:BC846*: NPN Transistor
R1-R22 R28-R56 R58-R64 = rcl:R-EU_: RESISTOR, European symbol
R23-R26 R57 R87 R93-R96 = rcl:R-EU_: RESISTOR, European symbol; SPICEPREFIX: R
RL1 RL2 = Erelay:G5LE-TEK
U1 U4 U7 = enko01:ACS712
U2 = enko01:STM32F334C6
U3 = enkohasip:LF101ESI
U5 U6 = enko01:SI8230
X1 = con-phoenix-381_l:MCV3: Mini-Combicon 3.81mm vertikal 3polig (ohne Gegenstecker)
X2 X3 X7 X8 = enko:RADE2